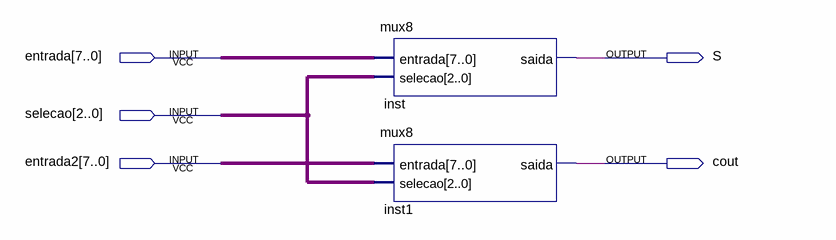
[diagram p0: schematic sheet]
// Quartus schematic adder.bdf as structural Verilog: 2 symbols, 5 pins
module adder (
  input  [7:0] entrada,
  input  [2:0] selecao,
  input  [7:0] entrada2,
  output S,
  output cout
);

  mux8 inst (.entrada(entrada), .selecao(selecao), .saida(S));
  mux8 inst1 (.entrada(entrada2), .selecao(selecao), .saida(cout));
endmodule
